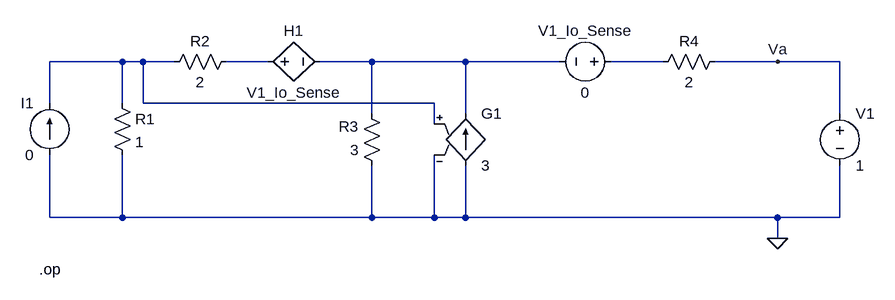
[diagram p0: schematic Draft2.asc]
Draft2.asc, the LTspice schematic file:
Version 4.1
SHEET 1 952 680
WIRE -208 112 -320 112
WIRE -176 112 -208 112
WIRE -128 112 -176 112
WIRE 16 112 -48 112
WIRE 176 112 96 112
WIRE 320 112 176 112
WIRE 464 112 320 112
WIRE 624 112 544 112
WIRE 800 112 704 112
WIRE 896 112 800 112
WIRE -320 176 -320 112
WIRE -208 176 -208 112
WIRE -176 176 -176 112
WIRE 272 176 -176 176
WIRE 176 192 176 112
WIRE 320 192 320 112
WIRE 896 192 896 112
WIRE 272 208 272 176
WIRE -320 352 -320 256
WIRE -208 352 -208 256
WIRE -208 352 -320 352
WIRE 176 352 176 272
WIRE 176 352 -208 352
WIRE 272 352 272 256
WIRE 272 352 176 352
WIRE 320 352 320 272
WIRE 320 352 272 352
WIRE 800 352 320 352
WIRE 896 352 896 272
WIRE 896 352 800 352
WIRE 800 384 800 352
FLAG 800 384 0
FLAG 800 112 Va
DATAFLAG -192 112 ""
SYMBOL res -224 160 R0
SYMATTR InstName R1
SYMATTR Value 1
SYMBOL res -32 96 R90
WINDOW 0 0 56 VBottom 2
WINDOW 3 32 56 VTop 2
SYMATTR InstName R2
SYMATTR Value 2
SYMBOL res 192 288 R180
WINDOW 0 36 76 Left 2
WINDOW 3 36 40 Left 2
SYMATTR InstName R3
SYMATTR Value 3
SYMBOL res 608 128 R270
WINDOW 0 32 56 VTop 2
WINDOW 3 0 56 VBottom 2
SYMATTR InstName R4
SYMATTR Value 2
SYMBOL current -320 256 R180
WINDOW 0 24 80 Left 2
WINDOW 3 24 0 Left 2
WINDOW 123 0 0 Left 0
WINDOW 39 0 0 Left 0
SYMATTR InstName I1
SYMATTR Value 0
SYMBOL h 0 112 R270
WINDOW 0 32 56 VTop 2
WINDOW 3 -32 56 VBottom 2
SYMATTR InstName H1
SYMATTR Value V1_Io_Sense
SYMATTR Value2 2
SYMBOL g 320 176 R0
SYMATTR InstName G1
SYMATTR Value 3
SYMBOL voltage 560 112 R90
WINDOW 0 -32 56 VBottom 2
WINDOW 3 32 56 VTop 2
WINDOW 123 0 0 Left 0
WINDOW 39 0 0 Left 0
SYMATTR InstName V1_Io_Sense
SYMATTR Value 0
SYMBOL voltage 896 176 R0
SYMATTR InstName V1
SYMATTR Value 1
TEXT -336 432 Left 2 !.op

The netlist it stands for:
* Draft2.asc
R1 N001 0 1
R2 N002 N001 2
R3 0 N003 3
R4 N004 Va 2
I1 0 N001 0
H1 N002 N003 V1_Io_Sense 2
G1 0 N003 N001 0 3
V1_Io_Sense N004 N003 0
V1 Va 0 1
.op
.backanno
.end